# EAGLE design spicboard-v3 (EAGLE 8.1.1)
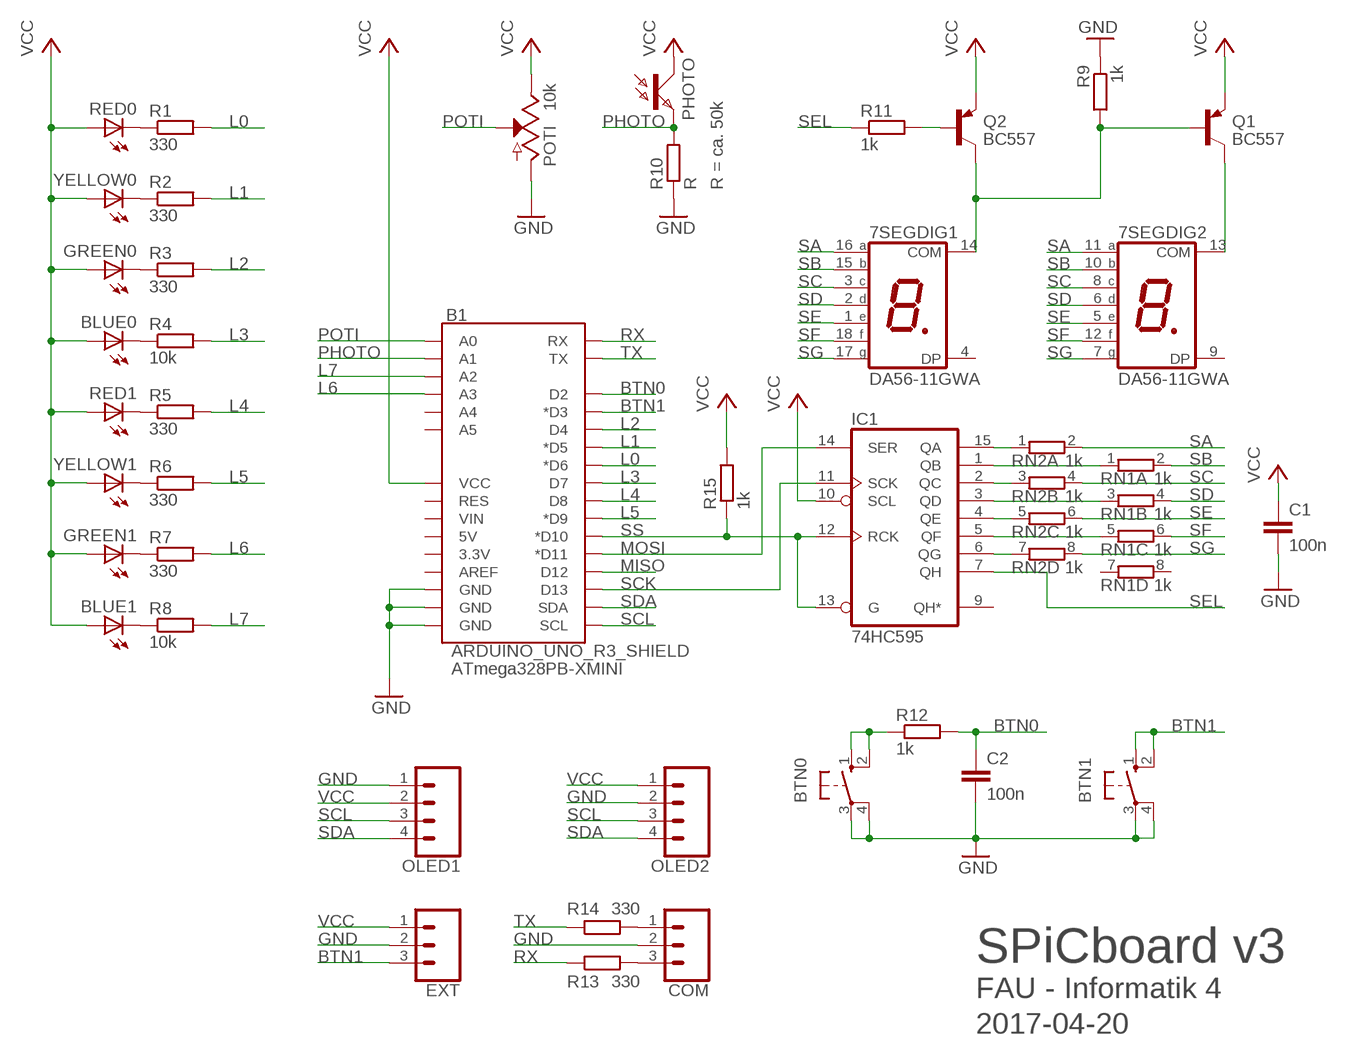
[diagram p0: schematic, sheet 1]

## Parts
7SEG  DA56-11GWA  [DA56]
B1  ARDUINO_UNO_R3_SHIELD  [UNO_R3_SHIELD_FINAL]
BLUE0  LED5MM  [LED5MM]
BLUE1  LED5MM  [LED5MM]
BTN0  10-XX  [B3F-10XX]
BTN1  10-XX  [B3F-10XX]
C1  100n  C2.5/2  [C2.5-2]
C2  100n  C2.5/2  [C2.5-2]
COM  CONN_03  [1X03]
EXT  CONN_03  [1X03]
GREEN0  LED5MM  [LED5MM]
GREEN1  LED5MM  [LED5MM]
IC1  74HC595  74HC595N  [DIL16]
OLED1  CONN_04  [1X04]
OLED2  CONN_04  [1X04]
PHOTO  PTPT  [PT]
POTI  10k  POTENTIOMETER-PTH-9MM-1/20W-20%  [POT-PTH-ALPS]
Q1  BC557  [TO92-EBC]
Q2  BC557  [TO92-EBC]
R1  330  R-EU_0207/10  [0207/10]
R2  330  R-EU_0207/10  [0207/10]
R3  330  R-EU_0207/10  [0207/10]
R4  10k  R-EU_0207/10  [0207/10]
R5  330  R-EU_0207/10  [0207/10]
R6  330  R-EU_0207/10  [0207/10]
R7  330  R-EU_0207/10  [0207/10]
R8  10k  R-EU_0207/10  [0207/10]
R9  1k  R-EU_0207/10  [0207/10]
R10  R  R-EU_0207/10  [0207/10]
R11  1k  R-EU_0207/10  [0207/10]
R12  1k  R-EU_0207/10  [0207/10]
R13  330  R-EU_0207/10  [0207/10]
R14  330  R-EU_0207/10  [0207/10]
R15  1k  R-EU_0207/10  [0207/10]
RED0  LED5MM  [LED5MM]
RED1  LED5MM  [LED5MM]
RN1  1k  E4R  [SIL8]
RN2  1k  E4R  [SIL8]
YELLOW0  LED5MM  [LED5MM]
YELLOW1  LED5MM  [LED5MM]

## Nets
BTN0: B1.D2 C2.1 R12.2
BTN1: B1.D3(*D3) BTN1.1(S) BTN1.2(S1) EXT.3
GND: B1.GND@0(GND) B1.GND@1(GND) B1.GND@2(GND) BTN0.3(P) BTN0.4(P1) BTN1.3(P) BTN1.4(P1) C1.2 C2.2 COM.2 EXT.2 OLED1.1 OLED2.2 POTI.P$3(A) R9.1 R10.1
L0: B1.D6(*D6) R1.2
L1: B1.D5(*D5) R2.2
L2: B1.D4 R3.2
L3: B1.D7 R4.2
L4: B1.D8 R5.2
L5: B1.D9(*D9) R6.2
L6: B1.A3 R7.2
L7: B1.A2 R8.2
MISO: B1.D12
MOSI: B1.D11(*D11) IC1.14(SER)
N$1: IC1.15(QA) RN2.1
N$2: R1.1 RED0.K(C)
N$3: R2.1 YELLOW0.K(C)
N$4: GREEN0.K(C) R3.1
N$5: BLUE0.K(C) R4.1
N$6: R5.1 RED1.K(C)
N$7: R6.1 YELLOW1.K(C)
N$8: GREEN1.K(C) R7.1
N$9: BLUE1.K(C) R8.1
N$10: IC1.2(QC) RN2.3
N$11: IC1.4(QE) RN2.5
N$12: IC1.6(QG) RN2.7
N$13: IC1.3(QD) RN1.3
N$14: IC1.1(QB) RN1.1
N$15: COM.1 R14.2
N$16: IC1.5(QF) RN1.5
N$17: 7SEG.13(DIG2:COM) Q1.C
N$18: 7SEG.14(DIG1:COM) Q1.B Q2.C R9.2
N$19: BTN0.1(S) BTN0.2(S1) R12.1
N$20: Q2.B R11.2
N$21: COM.3 R13.2
PHOTO: B1.A1 PHOTO.E R10.2
POTI: B1.A0 POTI.P$2(S)
RX: B1.RX R13.1
SA: 7SEG.11(DIG2:A) 7SEG.16(DIG1:A) RN2.2
SB: 7SEG.10(DIG2:B) 7SEG.15(DIG1:B) RN1.2
SC: 7SEG.3(DIG1:C) 7SEG.8(DIG2:C) RN2.4
SCK: B1.D13 IC1.11(SCK)
SCL: B1.SCL OLED1.3 OLED2.3
SD: 7SEG.2(DIG1:D) 7SEG.6(DIG2:D) RN1.4
SDA: B1.SDA OLED1.4 OLED2.4
SE: 7SEG.1(DIG1:E) 7SEG.5(DIG2:E) RN2.6
SEL: IC1.7(QH) R11.1
SF: 7SEG.12(DIG2:F) 7SEG.18(DIG1:F) RN1.6
SG: 7SEG.7(DIG2:G) 7SEG.17(DIG1:G) RN2.8
SS: B1.D10(*D10) IC1.12(RCK) IC1.13(G) R15.1
TX: B1.TX R14.1
VCC: B1.VCC BLUE0.A BLUE1.A C1.1 EXT.1 GREEN0.A GREEN1.A IC1.10(SCL) OLED1.2 OLED2.1 PHOTO.C POTI.P$1(E) Q1.E Q2.E R15.2 RED0.A RED1.A YELLOW0.A YELLOW1.A
Unconnected: 7SEG.4(DIG1:DP) 7SEG.9(DIG2:DP) B1.3.3V B1.5V B1.A4 B1.A5 B1.AREF B1.RES B1.VIN IC1.9(QH*) RN1.7 RN1.8

## Notes on the sheet
- R = ca. 50k
- ATmega328PB-XMINI
- SPiCboard v3
- FAU - Informatik 4
- 2017-04-20

## Power pins joined to a net without a drawn wire
GND: IC1.8(GND)
VCC: IC1.16(VCC)

## Library data of the parts
7SEG = spicboard-v3:DA56-11: 14.22mm (0.56INCH) DUAL DIGIT NUMERIC DISPLAYS Source: www.kingbright.com .. DA56-11SRWA.pdf; OC_FARNELL: unknown; OC_NEWARK: unknown
B1 = spicboard-v3:ARDUINO_UNO_R3_SHIELD: Arduino R3 Shield Footprint Shield form compatible with the Arduino Uno R3. SparkFun Products: MG2639 Cellular Shield <https://www.sparkfun.com/products/13120> MIDI Shield <https://www.sparkfun.com/products/12898> R3 Stackable Headers Kit <https://www.sparkfun.com/products/11417>
BLUE0 BLUE1 GREEN0 GREEN1 RED0 RED1 YELLOW0 YELLOW1 = spicboard-v3:LED: LED OSRAM: - CHIPLED LG R971, LG N971, LY N971, LG Q971, LY Q971, LO R971, LY R971 LH N974, LH R974 LS Q976, LO Q976, LY Q976 LO Q996 - Hyper CHIPLED LW Q18S LB Q993, LB Q99A, LB R99A - SideLED LS A670, LO A670, LY A670, LG A670, LP A670 LB A673, LV A673, LT A673, LW A673 LH A674 LY A675 LS A676, LA A676, LO A676, LY A676, LW A676 LS A679, LY A679, LG A679 - Hyper Micro SIDELED® LS Y876, LA Y876, LO Y876, LY Y876 LT Y87S - SmartLED LW L88C, LW L88S LB L89C, LB L89S, LG L890 LS L89K, LO L89K, LY L89K LS L896, LA L896, LO L896, LY L896 - TOPLED LS T670, LO T670, LY T670, LG T670, LP T670 LSG T670, LSP T670, LSY T670, LOP T670, LYG T670 LG T671, LOG T671, LSG T671 LB T673, LV T673, LT T673, LW T673 LH T674 LS T676, LA T676, LO T676, LY T676, LB T676, LH T676, LSB T676, LW T676 LB T67C, LV T67C, LT T67C, LS T67K, LO T67K, LY T67K, LW E67C LS E67B, LA E67B, LO E67B, LY E67B, LB E67C, LV E67C, LT E67C LW T67C LS T679, LY T679, LG T679 LS T770, LO T770, LY T770, LG T770, LP T770 LB T773, LV T773, LT T773, LW T773 LH T774 LS E675, LA E675, LY E675, LS T675 LS T776, LA T776, LO T776, LY T776, LB T776 LHGB T686 LT T68C, LB T68C - Hyper Mini TOPLED® LB M676 - Mini TOPLED Santana® LG M470 LS M47K, LO M47K, LY M47K Source: http://www.osram.convergy.de LUXEON: - LUMILED® LXK2-PW12-R00, LXK2-PW12-S00, LXK2-PW14-U00, LXK2-PW14-V00 LXK2-PM12-R00, LXK2-PM12-S00, LXK2-PM14-U00 LXK2-PE12-Q00, LXK2-PE12-R00, LXK2-PE12-S00, LXK2-PE14-T00, LXK2-PE14-U00 LXK2-PB12-K00, LXK2-PB12-L00, LXK2-PB12-M00, LXK2-PB14-N00, LXK2-PB14-P00, LXK2-PB14-Q00 LXK2-PR12-L00, LXK2-PR12-M00, LXK2-PR14-Q00, LXK2-PR14-R00 LXK2-PD12-Q00, LXK2-PD12-R00, LXK2-PD12-S00 LXK2-PH12-R00, LXK2-PH12-S00 LXK2-PL12-P00, LXK2-PL12-Q00, LXK2-PL12-R00 Source: www.luxeon.com KINGBRIGHT: KA-3528ASYC Source: www.kingbright.com
BTN0 BTN1 = switch-omron:10-XX: OMRON SWITCH; MPN: B3F-1000; OC_FARNELL: 176432; OC_NEWARK: 36M3542
C1 C2 = spicboard-v3:C: CAPACITOR naming: grid - package width
COM EXT = SparkFun-Connectors:CONN_03: Multi connection point. Often used as Generic Header-pin footprint for 0.1 inch spaced/style header connections On any of the 0.1 inch spaced packages, you can populate with these: Break Away Headers - Straight <https://www.sparkfun.com/products/116> (PRT-00116) Break Away Male Headers - Right Angle <https://www.sparkfun.com/products/553> (PRT-00553) Female Headers <https://www.sparkfun.com/products/115> (PRT-00115) Break Away Headers - Machine Pin <https://www.sparkfun.com/products/117> (PRT-00117) Break Away Female Headers - Swiss Machine Pin <https://www.sparkfun.com/products/743> (PRT-00743) Stackable Header - 3 Pin (Female, 0.1") <https://www.sparkfun.com/products/13875> (PRT-13875) For SCREWTERMINALS and SPRING TERMINALS visit here: Screw Terimnals on SparkFun.com <https://www.sparkfun.com/search/results?term=Screw+Terminals> (5mm/3.5mm/2.54mm spacing) This device is also useful as a general connection point to wire up your design to another part of your project. Our various solder wires solder well into these plated through hole pads. Hook-Up Wire - Assortment (Stranded, 22 AWG) <https://www.sparkfun.com/products/11375> (PRT-11375) Hook-Up Wire - Assortment (Solid Core, 22 AWG) <https://www.sparkfun.com/products/11367> (PRT-11367) View the entire wire category on our website here <https://www.sparkfun.com/categories/141> Special notes: Molex polarized connector foot print use with SKU : PRT-08232 with associated crimp pins and housings.
IC1 = 74xx-eu:74*595: 8-bit SHIFT REGISTER, output latch
OLED1 OLED2 = SparkFun-Connectors:CONN_04: Multi connection point. Often used as Generic Header-pin footprint for 0.1 inch spaced/style header connections On any of the 0.1 inch spaced packages, you can populate with these: Break Away Headers - Straight <https://www.sparkfun.com/products/116> (PRT-00116) Break Away Male Headers - Right Angle <https://www.sparkfun.com/products/553> (PRT-00553) Female Headers <https://www.sparkfun.com/products/115> (PRT-00115) Break Away Headers - Machine Pin <https://www.sparkfun.com/products/117> (PRT-00117) Break Away Female Headers - Swiss Machine Pin <https://www.sparkfun.com/products/743> (PRT-00743) For SCREWTERMINALS and SPRING TERMINALS visit here: Screw Terimnals on SparkFun.com <https://www.sparkfun.com/search/results?term=Screw+Terminals> (5mm/3.5mm/2.54mm spacing) This device is also useful as a general connection point to wire up your design to another part of your project. Our various solder wires solder well into these plated through hole pads. Hook-Up Wire - Assortment (Stranded, 22 AWG) <https://www.sparkfun.com/products/11375> (PRT-11375) Hook-Up Wire - Assortment (Solid Core, 22 AWG) <https://www.sparkfun.com/products/11367> (PRT-11367) View the entire wire category on our website here <https://www.sparkfun.com/categories/141> Special notes: Molex polarized connector foot print use with SKU : PRT-08231 with associated crimp pins and housings. 1MM SMD Version SKU: PRT-10208; PROD_ID: CONN-09696
PHOTO = spicboard-v3:PT
POTI = spicboard-v3:POTENTIOMETER: Potentiometer (Pot) Three-terminal potentiometers, with an adjustable wiper and two adjustable resistors. A pot can be used to create a configurable voltage divider, or as a variable resistor. Variants ALPS_POT and ALPS_POT_KIT - PTH, breadboard compatible, 9mm square pots Rotary Potentiometer - Linear (10k ohm) <https://www.sparkfun.com/products/9288> (COM-09288) The KIT variant exposes copper on only one side of the PTH pad, so the part can only be assembled on one side of the PCB. Useful for beginner soldering kits.; PROD_ID: RES-09177; SF_SKU: COM-09288
Q1 Q2 = transistor-pnp:BC557*: PNP Transistror
R1-R15 = spicboard-v3:R-EU_: RESISTOR, European symbol
RN1 RN2 = spicboard-v3:E4R: SIL RESISTOR; OC_FARNELL: unknown; OC_NEWARK: unknown

## Board
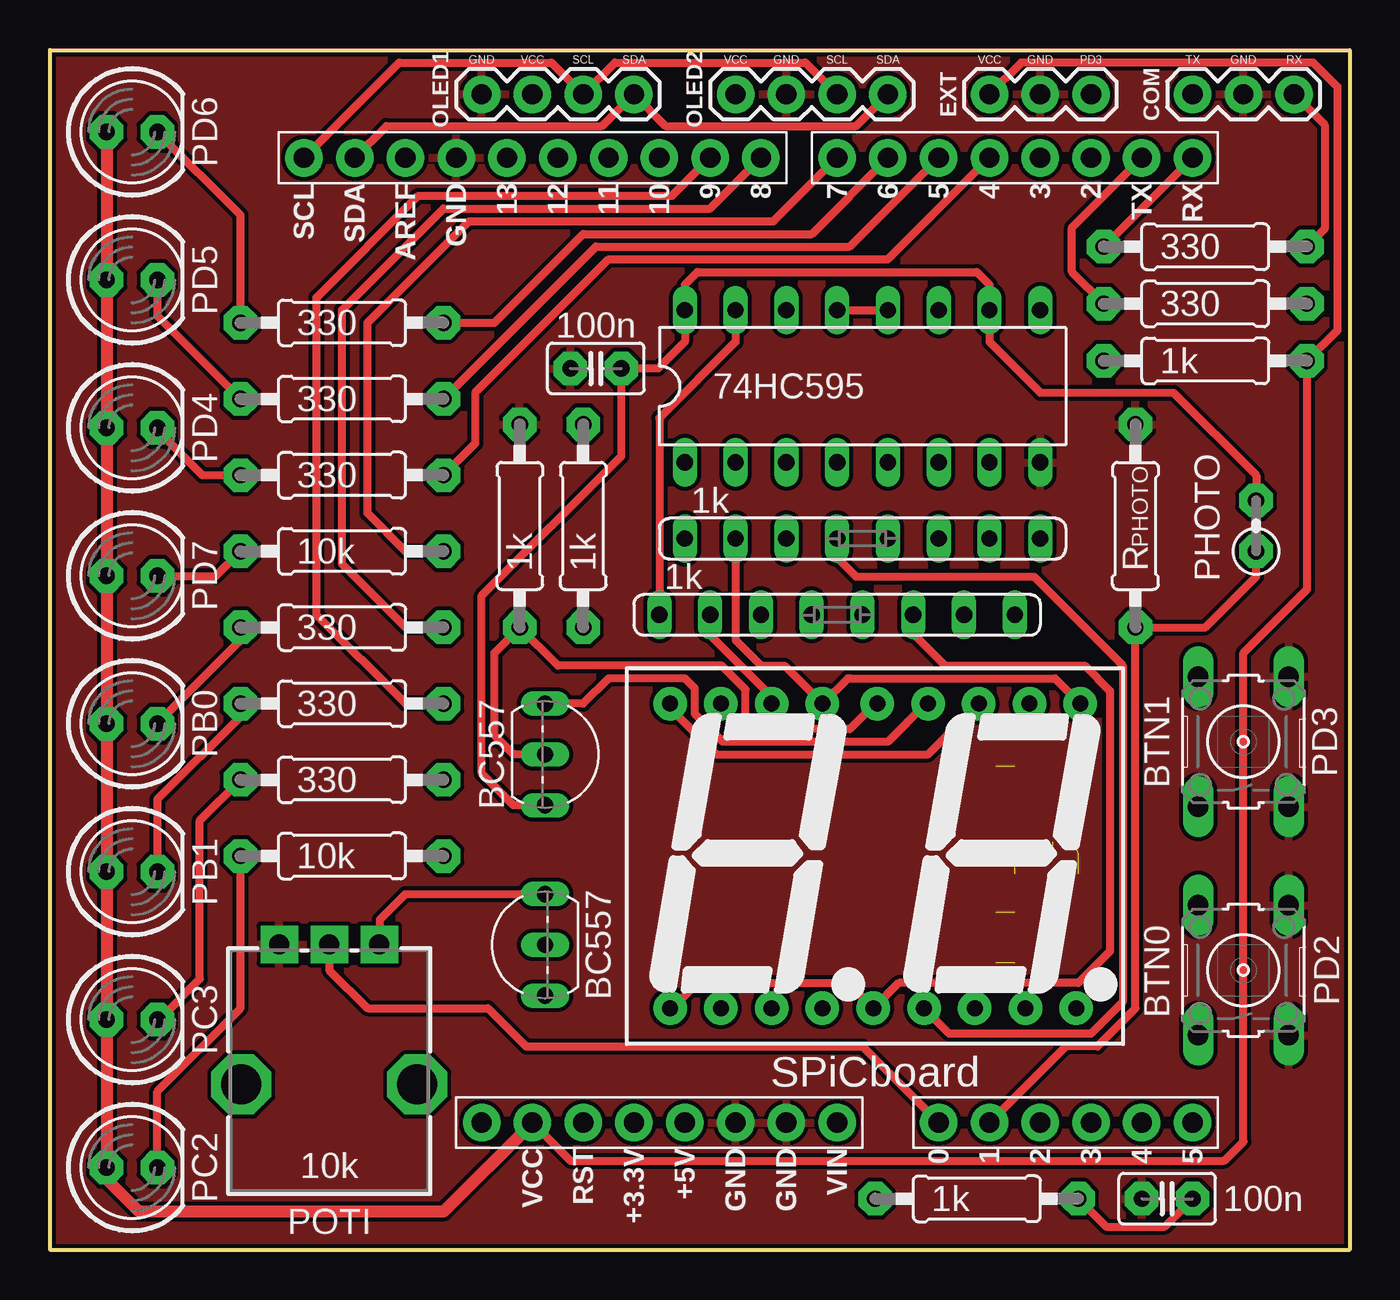
[diagram p1: board, top side]
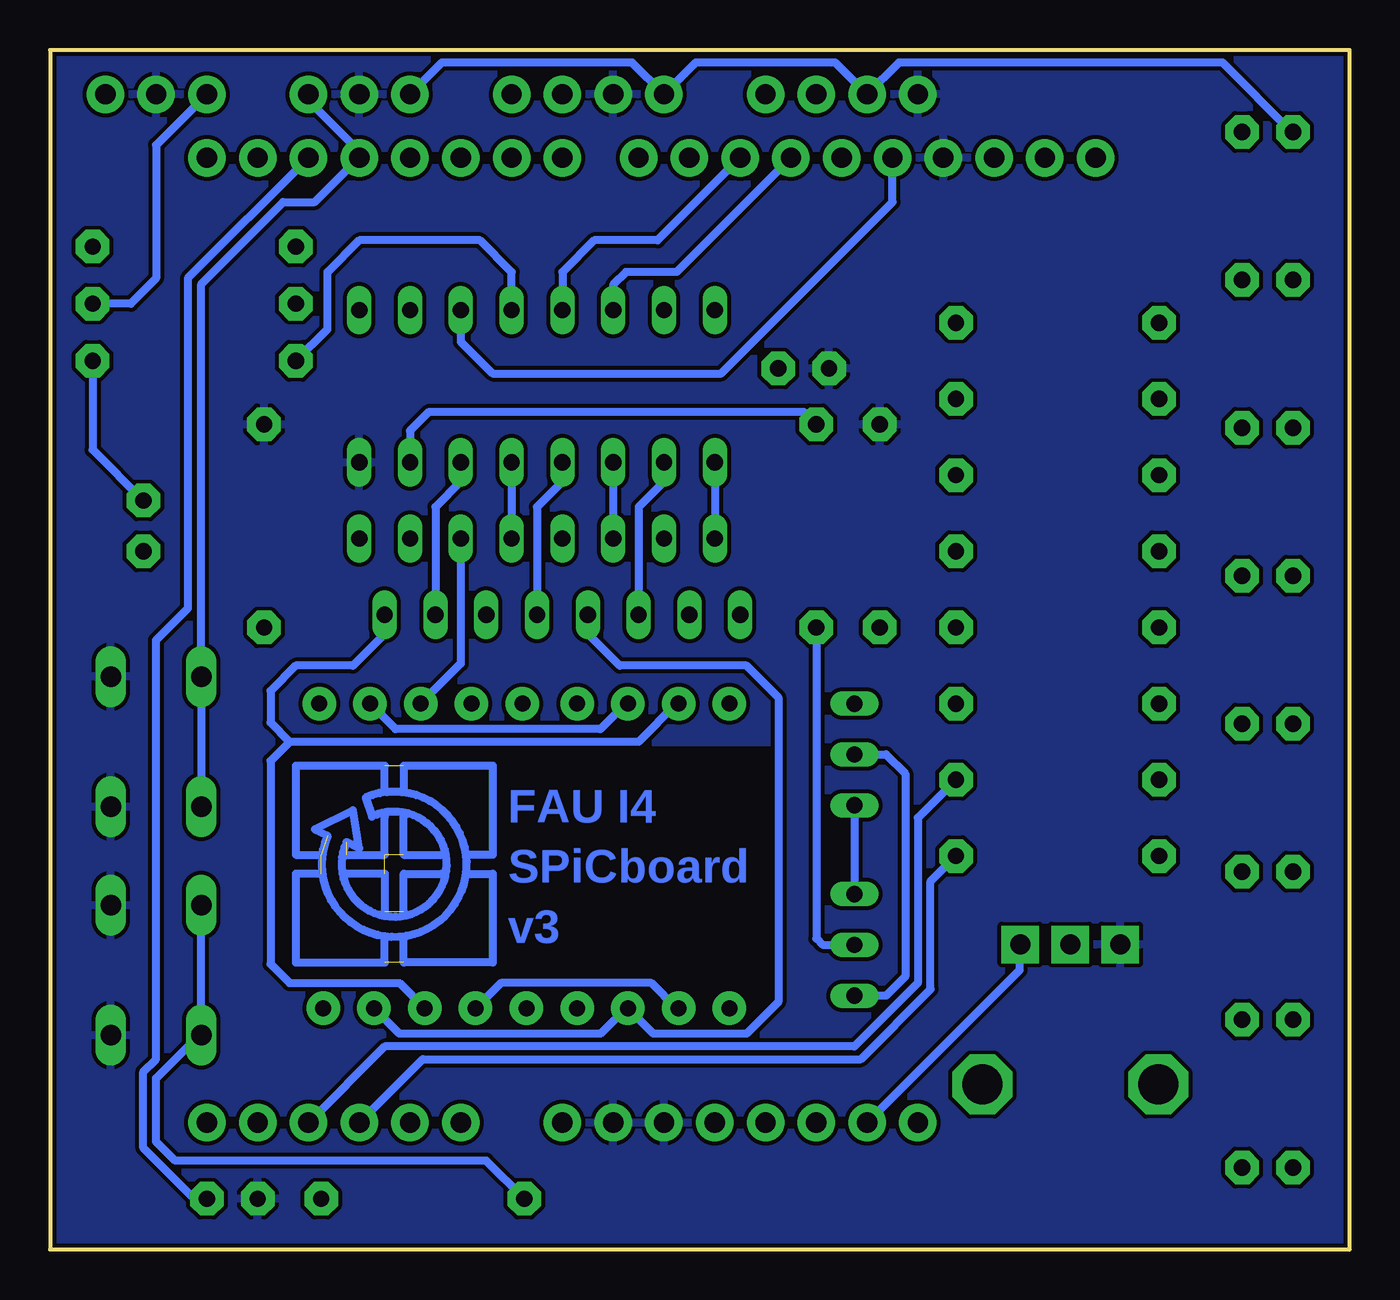
[diagram p2: board, bottom side, seen from below]

Size 65 x 60 mm. Coordinates in mm from the lower left corner, seen from the top.
Outline: 0,0 0,60 65,60 65,0 0,0
Copper layers (1*16): Top 0.018mm / dielectric 1.55mm / Bottom 0.018mm
Design rules "Multi-CB_2L_125um-Tracks_OL35um *": minimum track width 0.125mm, minimum drill 0.2mm, track to track 0.2mm, track to pad 0.2mm, pad to pad 0.2mm, via to via 0.2mm, smd to smd 0mil, copper to edge 0.2mm, drill to drill 0.2mm, minimum pad ring 0.125mm, minimum via ring 0.125mm, stop-mask expansion 2mil, vias tented up to drill 0.45mm, thermal gap 0.2mm
bRestrict: area 29.2,14 to 53.3,25

### Footprints (pad centres in the part's own frame; a part is rotated, then mirrored left to right if it is on the bottom)
DA56 = drill 0.8 pad 1.676: 1 -10.26,-7.62; 2 -7.72,-7.62; 3 -5.18,-7.62; 4 -2.64,-7.62; 5 -0.1,-7.62; 6 2.44,-7.62; 7 4.98,-7.62; 8 7.52,-7.62; 9 10.06,-7.62; 10 10.26,7.62; 11 7.72,7.62; 12 5.18,7.62; 13 2.64,7.62; 14 0.1,7.62; 15 -2.64,7.62; 16 -5.18,7.62; 17 -7.72,7.62; 18 -10.26,7.62
UNO_R3_SHIELD_FINAL = drill 1.016 pad 1.88: 3.3V 5.08,-29.21; 5V 7.62,-29.21; A0 20.32,-29.21; A1 22.86,-29.21; A2 25.4,-29.21; A3 27.94,-29.21; A4 30.48,-29.21; A5 33.02,-29.21; AREF -6.35,19.05; D2 27.94,19.05; D3 25.4,19.05; D4 22.86,19.05; D5 20.32,19.05; D6 17.78,19.05; D7 15.24,19.05; D8 11.43,19.05; D9 8.89,19.05; D10 6.35,19.05; D11 3.81,19.05; D12 1.27,19.05; D13 -1.27,19.05; GND@0 10.16,-29.21; GND@1 12.7,-29.21; GND@2 -3.81,19.05; NC -2.54,-29.21; RES 2.54,-29.21; RX 33.02,19.05; SCL -11.43,19.05; SDA -8.89,19.05; TX 30.48,19.05; VCC 0,-29.21; VIN 15.24,-29.21
LED5MM = drill 0.813 pad 1.676 octagon: A -1.27,0; K 1.27,0
B3F-10XX = drill 1.016 long: 1 -3.251,2.261; 2 3.251,2.261; 3 -3.251,-2.261; 4 3.251,-2.261
C2.5-2 = drill 0.813 pad 1.676 octagon: 1 -1.27,0; 2 1.27,0
1X03 = drill 1.016 pad 1.88: 1 0,0; 2 2.54,0; 3 5.08,0
DIL16 = drill 0.813 long: 1 -8.89,-3.81; 2 -6.35,-3.81; 3 -3.81,-3.81; 4 -1.27,-3.81; 5 1.27,-3.81; 6 3.81,-3.81; 7 6.35,-3.81; 8 8.89,-3.81; 9 8.89,3.81; 10 6.35,3.81; 11 3.81,3.81; 12 1.27,3.81; 13 -1.27,3.81; 14 -3.81,3.81; 15 -6.35,3.81; 16 -8.89,3.81
1X04 = drill 1.016 pad 1.88: 1 0,0; 2 2.54,0; 3 5.08,0; 4 7.62,0
PT = drill 0.813 pad 1.676 octagon: C 1.27,0; E -1.27,0
POT-PTH-ALPS = drill 1 pad 1.88 square: P$1 7,-2.5; P$2 7,0; P$3 7,2.5 | drill 2 octagon: P$4 0,-4.4; P$5 0,4.4
TO92-EBC = drill 0.813 long: B 0,-1.27; C -2.54,-1.27; E 2.54,-1.27
0207/10 = drill 0.813 pad 1.676 octagon: 1 -5.08,0; 2 5.08,0
SIL8 = drill 0.813 long: 1 -8.89,0; 2 -6.35,0; 3 -3.81,0; 4 -1.27,0; 5 1.27,0; 6 3.81,0; 7 6.35,0; 8 8.89,0

### Placement (x,y rotation side)
7SEG  41.27,19.68 0 top
B1  24.13,35.56 0 top
BLUE0  4.1,33.7 0 top
BLUE1  4.1,4.1 0 top
BTN0  59.69,13.97 90 top
BTN1  59.69,25.4 90 top
C1  27.3,44.07 180 top
C2  55.88,2.54 180 top
COM  57.15,57.78 0 top
EXT  46.99,57.78 0 top
GREEN0  4.1,41.1 0 top
GREEN1  4.1,11.5 0 top
IC1  40.64,43.18 0 top
OLED1  21.59,57.78 0 top
OLED2  34.29,57.78 0 top
PHOTO  60.33,36.2 90 top
POTI  13.97,8.26 90 top
Q1  26.04,24.77 270 top
Q2  23.5,15.24 90 top
R1  14.61,46.35 0 top
R2  14.61,42.55 0 top
R3  14.61,38.73 0 top
R4  14.61,34.92 0 top
R5  14.61,31.11 0 top
R6  14.61,27.3 0 top
R7  14.61,23.5 0 top
R8  14.61,19.68 0 top
R9  23.5,36.2 270 top
R10  54.29,36.2 270 top
R11  26.67,36.2 270 top
R12  46.35,2.54 0 top
R13  57.78,50.16 0 top
R14  57.78,47.31 0 top
R15  57.78,44.45 0 top
RED0  4.1,55.9 0 top
RED1  4.1,26.3 0 top
RN1  40.64,35.56 0 top
RN2  39.37,31.75 0 top
YELLOW0  4.1,48.5 0 top
YELLOW1  4.1,18.9 0 top

### Tracks (layer width: path | path; a pad name or v marks a point on that pad's centre or on a via)
BTN0
  Top 0.406: R12.2 52.83,1.14 55.75,1.14 C2.1
  Bottom 0.406: B1.D2 58.1,48.58 58.1,32.07 59.69,30.48 59.69,9.53 60.33,8.89 60.33,5.08 57.78,2.54 C2.1
BTN1
  Bottom 0.406: BTN1.1 BTN1.2 57.43,48.3 53.34,52.39 51.75,52.39 B1.D3 49.53,54.93 52.07,57.47 EXT.3
GND
  pour Top: 0,60.01 65.09,60.01 65.09,0 0,0
  pour Bottom: 0,60.01 65.09,60.01 65.09,0 0,0
L0
  Top 0.406: R1.2 22.23,46.35 26.67,50.8 38.1,50.8 B1.D6
L1
  Top 0.406: R2.2 27.3,50.16 40.01,50.16 B1.D5
L2
  Top 0.406: B1.D4 41.91,49.53 27.94,49.53 21.27,42.86 21.27,40.32 R3.2
L3
  Top 0.406: R4.2 17.78,34.92 15.88,36.83 15.88,46.35 20.95,51.44 36.2,51.44 B1.D7
L4
  Top 0.406: R5.2 17.78,31.11 14.61,34.29 14.61,46.99 19.68,52.07 33.02,52.07 B1.D8
L5
  Top 0.406: R6.2 17.78,27.3 13.34,31.75 13.34,47.62 18.41,52.7 31.11,52.7 B1.D9
L6
  Bottom 0.406: R7.2 21.59,21.59 21.59,13.34 24.77,10.16 48.26,10.16 B1.A3
L7
  Bottom 0.406: B1.A2 46.35,9.53 24.45,9.53 20.95,13.02 20.95,18.41 R8.2
MOSI
  Bottom 0.406: B1.D11 33.66,48.9 36.2,48.9 36.83,48.26 IC1.14
N$1
  Top 0.406: IC1.15 34.29,45.4 30.48,41.59 RN2.1
N$2
  Top 0.406: R1.1 9.53,51.74 RED0.K
N$3
  Top 0.406: YELLOW0.K 5.37,46.7 R2.1
N$4
  Top 0.406: GREEN0.K 5.37,40.98 7.62,38.73 R3.1
N$5
  Top 0.406: R4.1 8.26,33.66 5.42,33.66 BLUE0.K
N$6
  Top 0.406: RED1.K 5.34,26.3 9.53,30.48 R5.1
N$7
  Top 0.406: 9.53,26.67 R6.1 9.53,26.67 | YELLOW1.K 5.37,22.52 9.53,26.67
N$8
  Top 0.406: GREEN1.K 5.47,11.5 7.49,13.53 7.49,21.46 R7.1
N$9
  Top 0.406: BLUE1.K 5.37,7.91 9.53,12.06 R8.1
N$10
  Bottom 0.406: IC1.2 34.29,38.42 35.56,37.15 RN2.3
N$11
  Bottom 0.406: IC1.4 39.37,38.42 40.64,37.15 RN2.5
N$12
  Bottom 0.406: IC1.6 44.45,38.42 45.72,37.15 RN2.7
N$13
  Bottom 0.406: IC1.3 RN1.3
N$14
  Bottom 0.406: IC1.1 RN1.1
N$15
  Bottom 0.406: COM.1 59.69,55.24 59.69,48.58 60.96,47.31 R14.2
N$16
  Bottom 0.406: IC1.5 RN1.5
N$17
  Top 0.406: 7SEG.13 43.81,27.3 41.91,25.4 33.66,25.4 32.26,26.8 32.26,28.07 31.75,28.57 27.94,28.57 26.67,27.3 Q1.C
N$18
  Top 0.406: 7SEG.14 41.27,27.3 40.01,26.04 35.43,26.04 34.8,26.67 34.8,28 33.59,29.21 25.4,29.21 R9.2 22.23,29.84 22.23,25.72 23.18,24.77 Q1.B
  Bottom 0.406: Q1.B 23.18,24.77 22.23,23.81 22.23,13.65 23.18,12.7 Q2.C
N$19
  Bottom 0.406: R12.1 43.18,4.45 58.74,4.45 59.69,5.4 59.69,8.57 57.54,10.72 BTN0.1 BTN0.2
N$20
  Bottom 0.406: R11.2 26.67,15.56 26.35,15.24 Q2.B
N$21
  Top 0.406: COM.3 63.75,56.26 63.75,51.05 R13.2
N$22  (8 unrouted)
  Bottom 0.406: 45.4,19.75 47.31,19.75 47.31,21.65 | 44.13,19.75 42.86,19.75 42.86,24.19 47.31,24.19 47.31,22.92 | 48.26,22.92 48.26,24.19 52.7,24.19 52.7,19.75 51.44,19.75 | 50.16,19.75 48.26,19.75 48.26,21.65 | 44.13,18.8 42.86,18.8 42.86,14.35 47.31,14.35 47.31,15.62 | 47.31,16.89 47.31,18.8 45.4,18.8 | 48.26,16.89 48.26,18.8 50.16,18.8 | 51.44,18.8 52.7,18.8 52.7,14.35 48.26,14.35 48.26,15.62 | 49.53,20.07 49.85,21.97 51.75,21.02 51.12,20.7 arc-316 49.21,22.61 48.9,21.65 arc320 50.16,20.38 49.53,20.07
PHOTO
  Top 0.406: B1.A1 50.8,10.16 52.39,10.16 54.29,12.06 R10.2 57.78,31.11 60.33,33.66 PHOTO.E
POTI
  Top 0.406: POTI.P$2 13.97,13.97 15.88,12.06 21.91,12.06 23.81,10.16 40.64,10.16 B1.A0
RX
  Top 0.406: R13.1 B1.RX
SA
  Top 0.406: 7SEG.16 36.09,27.66 33.02,30.73 RN2.2
  Bottom 0.406: 7SEG.16 36.2,27.3 37.47,26.04 47.73,26.04 7SEG.11
SB
  Top 0.406: 7SEG.10 50.27,28.57 40.01,28.57 39.91,28.57 7SEG.15 36.73,29.21 35.56,29.21 34.29,30.48 RN1.2
SC
  Bottom 0.406: 7SEG.8 47.52,10.79 37.47,10.79 36.2,12.06 7SEG.3 34.83,10.79 30.16,10.79 28.57,12.38 28.57,27.62 30.16,29.21 36.51,29.21 38.1,30.8 RN2.4
SCK
  Bottom 0.406: IC1.11 44.45,45.4 42.86,43.81 31.43,43.81 22.86,52.39 B1.D13
SCL
  Top 0.406: B1.SCL 17.46,59.37 25.08,59.37 OLED1.3 28.26,59.37 37.78,59.37 OLED2.3
SD
  Top 0.406: 7SEG.6 44.98,10.79 52.07,10.79 53.66,12.38 53.66,29.21 49.21,33.66 40.32,33.66 39.37,34.61 RN1.4
  Bottom 0.406: 7SEG.2 33.66,12.06 34.92,13.34 42.45,13.34 7SEG.6
SDA
  Top 0.406: B1.SDA 16.83,56.2 27.62,56.2 OLED1.4 30.8,56.2 40.32,56.2 OLED2.4
SE
  Top 0.406: RN2.6 43.18,30.8 44.77,29.21 51.75,29.21 53.02,27.94 53.02,14.92 51.44,13.34 42.45,13.34 7SEG.5 39.91,13.34 32.38,13.34 31.02,11.96 7SEG.1
SEL
  Bottom 0.406: IC1.7 46.99,40.96 46.04,41.91 27.3,41.91 R11.1
SF
  Top 0.406: 7SEG.12 43.91,24.77 33.34,24.77 31.02,27.09 7SEG.18
  Bottom 0.406: RN1.6 44.45,29.31 7SEG.12
SG
  Bottom 0.406: 7SEG.17 33.66,27.3 35.56,25.4 53.02,25.4 | 46.35,12.16 7SEG.7 47.52,13.34 53.02,13.34 53.98,14.29 53.98,24.45 53.02,25.4 | RN2.8 48.26,30.8 49.85,29.21 52.7,29.21 53.98,27.94 53.98,26.35 53.02,25.4
SS
  Top 0.406: IC1.13 IC1.12
  Bottom 0.406: R15.1 51.12,46.04 51.12,48.9 49.53,50.48 43.5,50.48 41.91,48.9 IC1.12 | B1.D10 34.61,50.48 37.78,50.48 39.37,48.9 IC1.13
TX
  Top 0.406: R14.1 51.12,48.9 51.12,51.12 B1.TX
VCC
  Top 0.406: Q2.E 17.78,17.78 16.51,16.51 16.51,15.29 POTI.P$1 | 2.88,4.1 BLUE1.A | Q1.E 23.18,22.23 21.59,23.81 21.59,32.7 28.57,39.69 C1.1 30.42,44.07 31.75,45.4 IC1.16 31.75,48.26 32.38,48.9 46.35,48.9 46.99,48.26 IC1.10 46.99,45.4 49.53,42.86 56.2,42.86 60.33,38.73 PHOTO.C | B1.VCC 26.04,4.45 58.74,4.45 59.69,5.4 59.69,29.84 62.87,33.02 R15.2 64.39,45.97 64.39,58.17 63.18,59.37 48.58,59.37 EXT.1
  Top 0.61: RED0.A YELLOW0.A GREEN0.A BLUE0.A RED1.A YELLOW1.A GREEN1.A BLUE1.A | 2.79,4.19 2.79,3.56 4.45,1.91 19.68,1.91 B1.VCC
  Bottom 0.406: Q1.E Q2.E | POTI.P$1 16.5,15.26 16.51,15.24 16.51,13.97 B1.VCC | RED0.A 2.88,55.9 6.35,59.37 22.54,59.37 OLED1.2 25.72,59.37 32.7,59.37 OLED2.1 35.88,59.37 45.4,59.37 EXT.1 | R15.2 62.87,40.01 PHOTO.C

### Text on the board
Bottom: FAU I4 / SPiCboard / v3
tNames: GND | VCC | SCL | SDA | VCC | GND | SCL | SDA | VCC | GND | PD3 | TX | GND | RX | PD6 | PD5 | PD4 | PHOTO | PD7 | PB0 | PD3 | PB1 | PD2 | PC3 | SPiCboard | PC2